# Altium schematic sheet [11]-Motor Driver_DRV8701_2.SchDoc
size A4; Organization: Altium Limited; Address1: L3, 12a Rodborough Rd; Address2: Frenchs Forest; Address3: NSW; Address4: Australia 2086
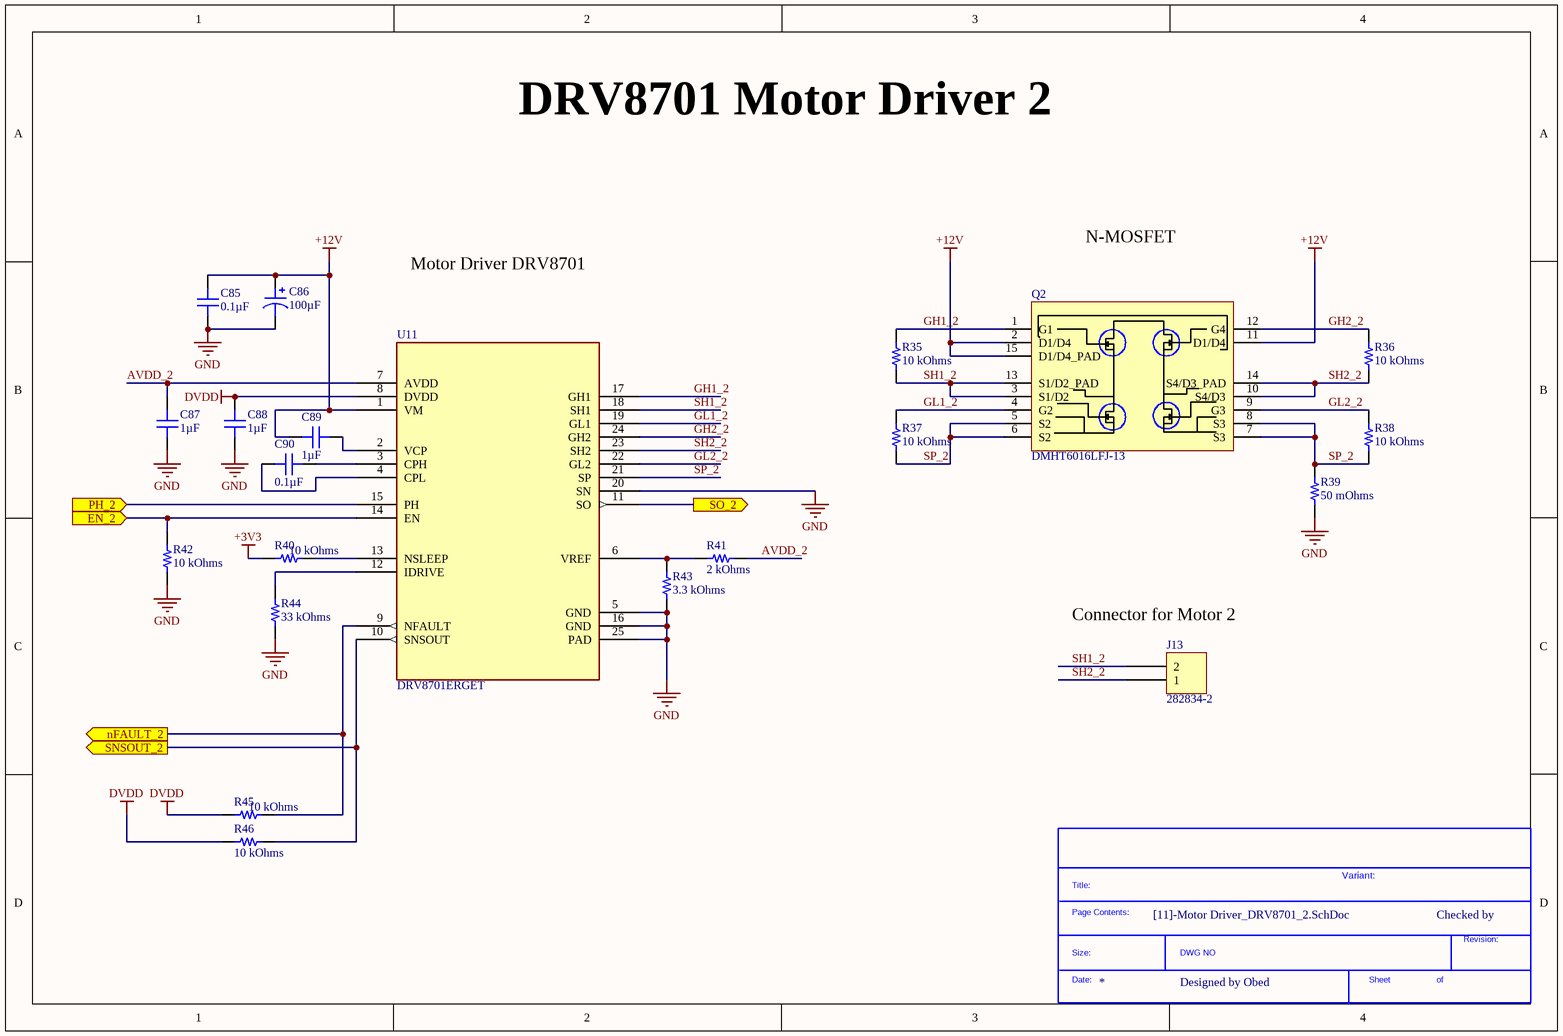
[diagram p0: [11]-Motor Driver_DRV8701_2.SchDoc]

## Parts
*?  SDTitleBlock  (value not drawn)  (graphical)
C85  0.1µF  [CAP 0805_2012]
C86  100µF  [CAP ALSMD 8.3MM H10.5MM]
C87  1µF  [CAP 0805_2012]
C88  1µF  [CAP 0805_2012]
C89  1µF  [CAP 0805_2012]
C90  0.1µF  [CAP 0805_2012]
J13  282834-2  [TE 282834-2]
Q2  DMHT6016LFJ-13  [DFN5045-12_33_212_27X15_SMD_1]
R35  10 kOhms  [RES 0805_2012]
R36  10 kOhms  [RES 0805_2012]
R37  10 kOhms  [RES 0805_2012]
R38  10 kOhms  [RES 0805_2012]
R39  50 mOhms  [RES 2512_6432]
R40  10 kOhms  [RES 0805_2012]
R41  2 kOhms  [RES 0603_1608]
R42  10 kOhms  [RES 0805_2012]
R43  3.3 kOhms  [RES 0603_1608]
R44  33 kOhms  [RES 0805_2012]
R45  10 kOhms  [RES 0805_2012]
R46  10 kOhms  [RES 0805_2012]
U11  DRV8701ERGET  [QFN50P400X400X100-25N]

## Ports
EN_2 (in), nFAULT_2 (out), PH_2 (in), SNSOUT_2 (out), SO_2 (out)

## Nets
+3V3: R40.2
+12V: C85.1 C86.1 C89.2 Q2.2(D1/D4) Q2.11(D1/D4) Q2.15(D1/D4_PAD) U11.1(VM)
DVDD: C88.2 R45.2 R46.2 U11.8(DVDD)
GND: C85.2 C86.2 C87.1 C88.1 R39.1 R42.2 R43.1 R44.1 U11.5(GND) U11.16(GND) U11.20(SN) U11.25(PAD)
AVDD_2: C87.2 R41.1 U11.7(AVDD)
EN_2: R42.1 U11.14(EN) ; port EN_2
GH1_2: Q2.1(G1) R35.2 U11.17(GH1)
GH2_2: Q2.12(G4) R36.2 U11.24(GH2)
GL1_2: Q2.4(G2) R37.2 U11.19(GL1)
GL2_2: Q2.9(G3) R38.2 U11.22(GL2)
nFAULT_2: R45.1 U11.9(NFAULT) ; port nFAULT_2
PH_2: U11.15(PH) ; port PH_2
SH1_2: J13.2 Q2.3(S1/D2) Q2.13(S1/D2_PAD) R35.1 U11.18(SH1)
SH2_2: J13.1 Q2.10(S4/D3) Q2.14(S4/D3_PAD) R36.1 U11.23(SH2)
SNSOUT_2: R46.1 U11.10(SNSOUT) ; port SNSOUT_2
SO_2: U11.11(SO) ; port SO_2
SP_2: Q2.5(S2) Q2.6(S2) Q2.7(S3) Q2.8(S3) R37.1 R38.1 R39.2 U11.21(SP)
NetC89_1: C89.1 U11.2(VCP)
NetC90_1: C90.1 U11.3(CPH)
NetC90_2: C90.2 U11.4(CPL)
NetR40_1: R40.1 U11.13(NSLEEP)
NetR41_2: R41.2 R43.2 U11.6(VREF)
NetR44_2: R44.2 U11.12(IDRIVE)

## Notes on the sheet
- DRV8701 Motor Driver 2
- N-MOSFET
- Motor Driver DRV8701
- (near J13) Connector for Motor 2
- Variant:
- Checked by
- Designed by Obed
- Title
- Size:
- Date:
- File:
- A2
- Number:
- Time:
- Revision:
- Sheet
- of
- (in symbol SDTitleBlock) Title:; Page Contents:; Revision:; Size:; DWG NO; Date:; Sheet; of

## Library data of the parts
C85 C90 = 0805J0500104KXT: CAP CER 0.1UF 50V X7R 0805; Manufacturer: Knowles Syfer; Tolerance: ±10%; Part Number: 0805J0500104KXT; Value: 0.1µF; Applications: General Purpose; Capacitance: 0.1µF; ComponentLink1Description: Datasheet; ComponentLink1URL: https://www.knowlescapacitors.com/getattachment/2dbfc8bc-e2b3-4b4d-afb1-43b011b9ebe0/High-Std-Voltage.aspx; ComponentLink2Description: DigiKey Link; ComponentLink2URL: http://digikey.com/product-detail/en/knowles-syfer/0805J0500104KXT/1608-1000-1-ND/5730199; Device Package: 0805 (2012 Metric); LastUpdated: 02/09/2020 01:04:31; Lifecycle Status: Active; Minimum Order: 1; Mounting Type: Surface Mount, MLCC; Operating Temperature: -55°C ~ 125°C; Package / Case: 0805 (2012 Metric); Packaging: TapeAndReel; PartId: 8322; Part Status: Active; Price: 0.17; Series: -; Size / Dimension: 0.079" L x 0.049" W (2.00mm x 1.25mm); Supplier 1: DigiKey; Supplier Part Number 1: 1608-1000-1-ND; Temperature Coefficient: X7R; Thickness (Max): 0.051" (1.30mm); Voltage - Rated: 50V
C86 = EDT107M025A9MAA: CAP ALUM SMD 125C 100UF 25VDC; Manufacturer: KEMET; Lifetime @ Temp.: 2000 Hrs @ 125°C; Polarization: Polar; Ripple Current @ High Frequency: 156mA @ 10kHz; Ripple Current @ Low Frequency: 130mA @ 120Hz; Surface Mount Land Size: 0.327" L x 0.327" W (8.30mm x 8.30mm); Tolerance: ±20%; Voltage - Rated: 25V; Part Number: EDT107M025A9MAA; Applications: General Purpose; Capacitance: 100µF; ComponentLink1Description: Datasheet; ComponentLink1URL: https://api.kemet.com/component-edge/download/datasheet/EDT107M025A9MAA.pdf; ComponentLink2Description: DigiKey Link; ComponentLink2URL: http://digikey.com/product-detail/en/kemet/EDT107M025A9MAA/399-18156-1-ND/9354357; Device Package: Radial, Can - SMD; Height - Seated (Max): 0.413" (10.50mm); LastUpdated: 02/09/2020 01:25:14; Lifecycle Status: Active; Minimum Order: 1; Mounting Type: Surface Mount; Operating Temperature: -40°C ~ 125°C; Package / Case: Radial, Can - SMD; Packaging: TapeAndReel; PartId: 7637; Part Status: Active; Price: 0.23; Series: EDT; Size / Dimension: 0.315" Dia (8.00mm); Supplier 1: DigiKey; Supplier Part Number 1: 399-18156-1-ND; Value: 100µF
C87-C89 = 08055C105K4T2A: CAP CER 1UF 50V X7R 0805; Manufacturer: AVX Corporation; Tolerance: ±10%; Part Number: 08055C105K4T2A; Value: 1µF; Applications: Automotive; Capacitance: 1µF; ComponentLink1Description: Datasheet; ComponentLink1URL: http://datasheets.avx.com/AutoMLCC.pdf; ComponentLink2Description: DigiKey Link; ComponentLink2URL: http://digikey.com/product-detail/en/avx-corporation/08055C105K4T2A/478-9556-1-ND/5322894; Device Package: 0805 (2012 Metric); LastUpdated: 02/09/2020 01:04:35; Lifecycle Status: Active; Minimum Order: 1; Mounting Type: Surface Mount, MLCC; Operating Temperature: -55°C ~ 125°C; Package / Case: 0805 (2012 Metric); Packaging: TapeAndReel; PartId: 6460; Part Status: Active; Price: 0.08; Ratings: AEC-Q200; Series: -; Size / Dimension: 0.079" L x 0.049" W (2.00mm x 1.25mm); Supplier 1: DigiKey; Supplier Part Number 1: 478-9556-1-ND; Temperature Coefficient: X7R; Thickness (Max): 0.055" (1.40mm); Voltage - Rated: 50V
J13 = 282834-2: TERM BLK 2P SIDE ENT 2.54MM PCB; Manufacturer: TE Connectivity AMP Connectors; Current: 10A; Mating Orientation: Horizontal with Board; Number of Levels: 1; Pitch: 0.100" (2.54mm); Positions Per Level: 2; Voltage: 150V; Wire Gauge: 16-30 AWG; Wire Termination: Screw - Rising Cage Clamp; Part Number: 282834-2; Color: Green; ComponentLink1Description: Datasheet; ComponentLink1URL: https://www.te.com/commerce/DocumentDelivery/DDEController?Action=srchrtrv&DocNm=282834&DocType=Customer+Drawing&DocLang=English; ComponentLink2Description: DigiKey Link; ComponentLink2URL: http://digikey.com/product-detail/en/te-connectivity-amp-connectors/282834-2/A98333-ND/1150135; LastUpdated: 15/01/2020 04:15:38; Lifecycle Status: Active; Minimum Order: 1; Mounting Type: Through Hole; Packaging: Bulk; Part Status: Active; Price: 0.88; Series: Buchanan; Supplier 1: DigiKey; Supplier Part Number 1: A98333-ND
Q2 = MOSFET-N_60V-14.8A-V-DFN5045-12: Mosfet Array 4 N-Channel 14.8A (Ta) Surface Mount V-DFN5045-12; Manufacturer: Diodes; Supplier 1: Digi-Key; Manufacturer Part Number: DMHT6016LFJ-13; Category: MOSFETs; Pricing 1: 1=1.65000, 10=1.48400, 25=1.40040, 100=1.19310, 500=0.98020, 1000=0.81217 (USD); Mount: Surface Mount; Packaging: Tape and Reel; ComponentLink1URL: https://www.diodes.com/assets/Datasheets/DMHT6016LFJ.pdf?src-supplier=Digi-Key; ComponentLink1Description: https://www.diodes.com/assets/Datasheets/DMHT6016LFJ.pdf?src-supplier=Digi-Key; Supplier Part Number 1: DMHT6016LFJ-13DICT-ND
R35-R38 R40 R42 R45 R46 = CRCW080510K0FKEA: RES SMD 10K OHM 1% 1/8W 0805; Manufacturer: Vishay Dale; Power (Watts): 0.125W, 1/8W; Temperature Coefficient: ±100ppm/°C; Part Number: CRCW080510K0FKEA; Value: 10 kOhms; ComponentLink1Description: Datasheet; ComponentLink1URL: http://www.vishay.com/docs/20035/dcrcwe3.pdf; ComponentLink2Description: DigiKey Link; ComponentLink2URL: http://digikey.com/product-detail/en/vishay-dale/CRCW080510K0FKEA/541-10.0KCCT-ND/1180897; Composition: Thick Film; Device Package: 0805 (2012 Metric); Features: Automotive AEC-Q200; Height - Seated (Max): 0.020" (0.50mm); LastUpdated: 02/09/2020 01:15:23; Lifecycle Status: Active; Minimum Order: 1; Number of Terminations: 2; Operating Temperature: -55°C ~ 155°C; Package / Case: 0805 (2012 Metric); Packaging: TapeAndReel; PartId: 28101; Part Status: Active; Price: 0.01; Ratings: AEC-Q200; Resistance: 10 kOhms; Series: CRCW; Size / Dimension: 0.079" L x 0.049" W (2.00mm x 1.25mm); Supplier 1: DigiKey; Supplier Part Number 1: 541-10.0KCCT-ND; Supplier Device Package: 0805; Tolerance: ±1%
R39 = PA2512FKF7W0R05E: METAL CURRENT SENSOR 2512 1% 100; Manufacturer: Yageo; Power (Watts): 2W; Temperature Coefficient: ±100ppm/°C; Part Number: PA2512FKF7W0R05E; ComponentLink1Description: Datasheet; ComponentLink1URL: http://www.yageo.com/documents/recent/PYu-PA_E_51_RoHS_10.pdf; ComponentLink2Description: DigiKey Link; ComponentLink2URL: http://digikey.com/product-detail/en/yageo/PA2512FKF7W0R05E/YAG6100CT-ND/9696554; Composition: Metal Element; Device Package: 2512 (6432 Metric); Features: Automotive AEC-Q200, Current Sense, Moisture Resistant; Height - Seated (Max): 0.035" (0.88mm); LastUpdated: 02/09/2020 01:26:58; Lifecycle Status: Active; Minimum Order: 1; Number of Terminations: 2; Operating Temperature: -55°C ~ 170°C; Package / Case: 2512 (6432 Metric); Packaging: TapeAndReel; Part Status: Active; Price: 0.20; Ratings: AEC-Q200; Resistance: 50 mOhms; Series: PA_E; Size / Dimension: 0.250" L x 0.125" W (6.35mm x 3.18mm); Supplier 1: DigiKey; Supplier Part Number 1: YAG6100CT-ND; Supplier Device Package: 2512; Tolerance: ±1%; Value: 50 mOhms
R41 = RMCF0603FT2K00: RES 2K OHM 1% 1/10W 0603; Manufacturer: Stackpole Electronics Inc; Power (Watts): 0.1W, 1/10W; Temperature Coefficient: ±100ppm/°C; Part Number: RMCF0603FT2K00; Value: 2 kOhms; ComponentLink1Description: Datasheet; ComponentLink1URL: https://www.seielect.com/catalog/sei-rmcf_rmcp.pdf; ComponentLink2Description: DigiKey Link; ComponentLink2URL: http://digikey.com/product-detail/en/stackpole-electronics-inc/RMCF0603FT2K00/RMCF0603FT2K00CT-ND/1943009; Composition: Thick Film; Device Package: 0603 (1608 Metric); Features: Automotive AEC-Q200; Height - Seated (Max): 0.022" (0.55mm); LastUpdated: 02/09/2020 01:10:22; Lifecycle Status: Active; Minimum Order: 1; Number of Terminations: 2; Operating Temperature: -55°C ~ 155°C; Package / Case: 0603 (1608 Metric); Packaging: CutTape; PartId: 6085; Part Status: Active; Price: 0.10; Ratings: AEC-Q200; Resistance: 2 kOhms; Series: RMCF; Size / Dimension: 0.061" L x 0.031" W (1.55mm x 0.80mm); Supplier 1: DigiKey; Supplier Part Number 1: RMCF0603FT2K00CT-ND; Supplier Device Package: 0603; Tolerance: ±1%
R43 = CRGP0603F3K3: CRGP 0603 3K3 1%; Manufacturer: TE Connectivity Passive Product; Power (Watts): 0.25W, 1/4W; Temperature Coefficient: ±100ppm/°C; Part Number: CRGP0603F3K3; Value: 3.3 kOhms; ComponentLink1Description: Datasheet; ComponentLink1URL: https://www.te.com/commerce/DocumentDelivery/DDEController?Action=srchrtrv&DocNm=9-1773463-9&DocType=DS&DocLang=English; ComponentLink2Description: DigiKey Link; ComponentLink2URL: http://digikey.com/product-detail/en/te-connectivity-passive-product/CRGP0603F3K3/A130422CT-ND/8578254; Composition: Thick Film; Device Package: 0603 (1608 Metric); Features: Pulse Withstanding; Height - Seated (Max): 0.022" (0.55mm); LastUpdated: 02/09/2020 01:10:24; Lifecycle Status: Active; Minimum Order: 1; Number of Terminations: 2; Operating Temperature: -55°C ~ 155°C; Package / Case: 0603 (1608 Metric); Packaging: TapeAndReel; PartId: 5037; Part Status: Active; Price: 0.02; Resistance: 3.3 kOhms; Series: CRGP; Size / Dimension: 0.063" L x 0.031" W (1.60mm x 0.80mm); Supplier 1: DigiKey; Supplier Part Number 1: A130422CT-ND; Supplier Device Package: 0603; Tolerance: ±1%
R44 = RMCF0805FT33K0: RES 33K OHM 1% 1/8W 0805; Manufacturer: Stackpole Electronics Inc; Power (Watts): 0.125W, 1/8W; Temperature Coefficient: ±100ppm/°C; Part Number: RMCF0805FT33K0; Value: 33 kOhms; ComponentLink1Description: Datasheet; ComponentLink1URL: https://www.seielect.com/catalog/sei-rmcf_rmcp.pdf; ComponentLink2Description: DigiKey Link; ComponentLink2URL: http://digikey.com/product-detail/en/stackpole-electronics-inc/RMCF0805FT33K0/RMCF0805FT33K0CT-ND/1942464; Composition: Thick Film; Device Package: 0805 (2012 Metric); Features: Automotive AEC-Q200; Height - Seated (Max): 0.026" (0.65mm); LastUpdated: 02/09/2020 01:15:14; Lifecycle Status: Active; Minimum Order: 1; Number of Terminations: 2; Operating Temperature: -55°C ~ 155°C; Package / Case: 0805 (2012 Metric); Packaging: CutTape; PartId: 32416; Part Status: Active; Price: 0.10; Ratings: AEC-Q200; Resistance: 33 kOhms; Series: RMCF; Size / Dimension: 0.079" L x 0.049" W (2.00mm x 1.25mm); Supplier 1: DigiKey; Supplier Part Number 1: RMCF0805FT33K0CT-ND; Supplier Device Package: 0805; Tolerance: ±1%
U11 = IC_DRV8701ERGET: IC MOTOR DRIVER 0V-5.5V 24VQFN; Manufacturer: Texas Instruments; Supplier 1: Digi-Key; Manufacturer Part Number: DRV8701ERGET; Category: Integrated Circuits (ICs); Pricing 1: 1=2.52000, 10=2.26100, 25=2.13320, 100=1.81750 (USD); Mount: Surface Mount; Case/Package: VQFN; ComponentLink1URL: http://www.ti.com/general/docs/lit/getliterature.tsp?genericPartNumber=DRV8701&&fileType=pdf&src-supplier=Avnet; ComponentLink1Description: http://www.ti.com/general/docs/lit/getliterature.tsp?genericPartNumber=DRV8701&&fileType=pdf&src-supplier=Avnet; ComponentLink2URL: http://www.ti.com/lit/ds/symlink/drv8701.pdf?src-supplier=Digi-Key; ComponentLink2Description: http://www.ti.com/lit/ds/symlink/drv8701.pdf?src-supplier=Digi-Key